# EasyEDA schematic Schematic.json
TITLE: Slide Guardian; REV: 1.0; Date: 2024-06-06; Sheet: 1/1; Drawn By: Internet de las Cosas; Company: Universidad de Cartagena
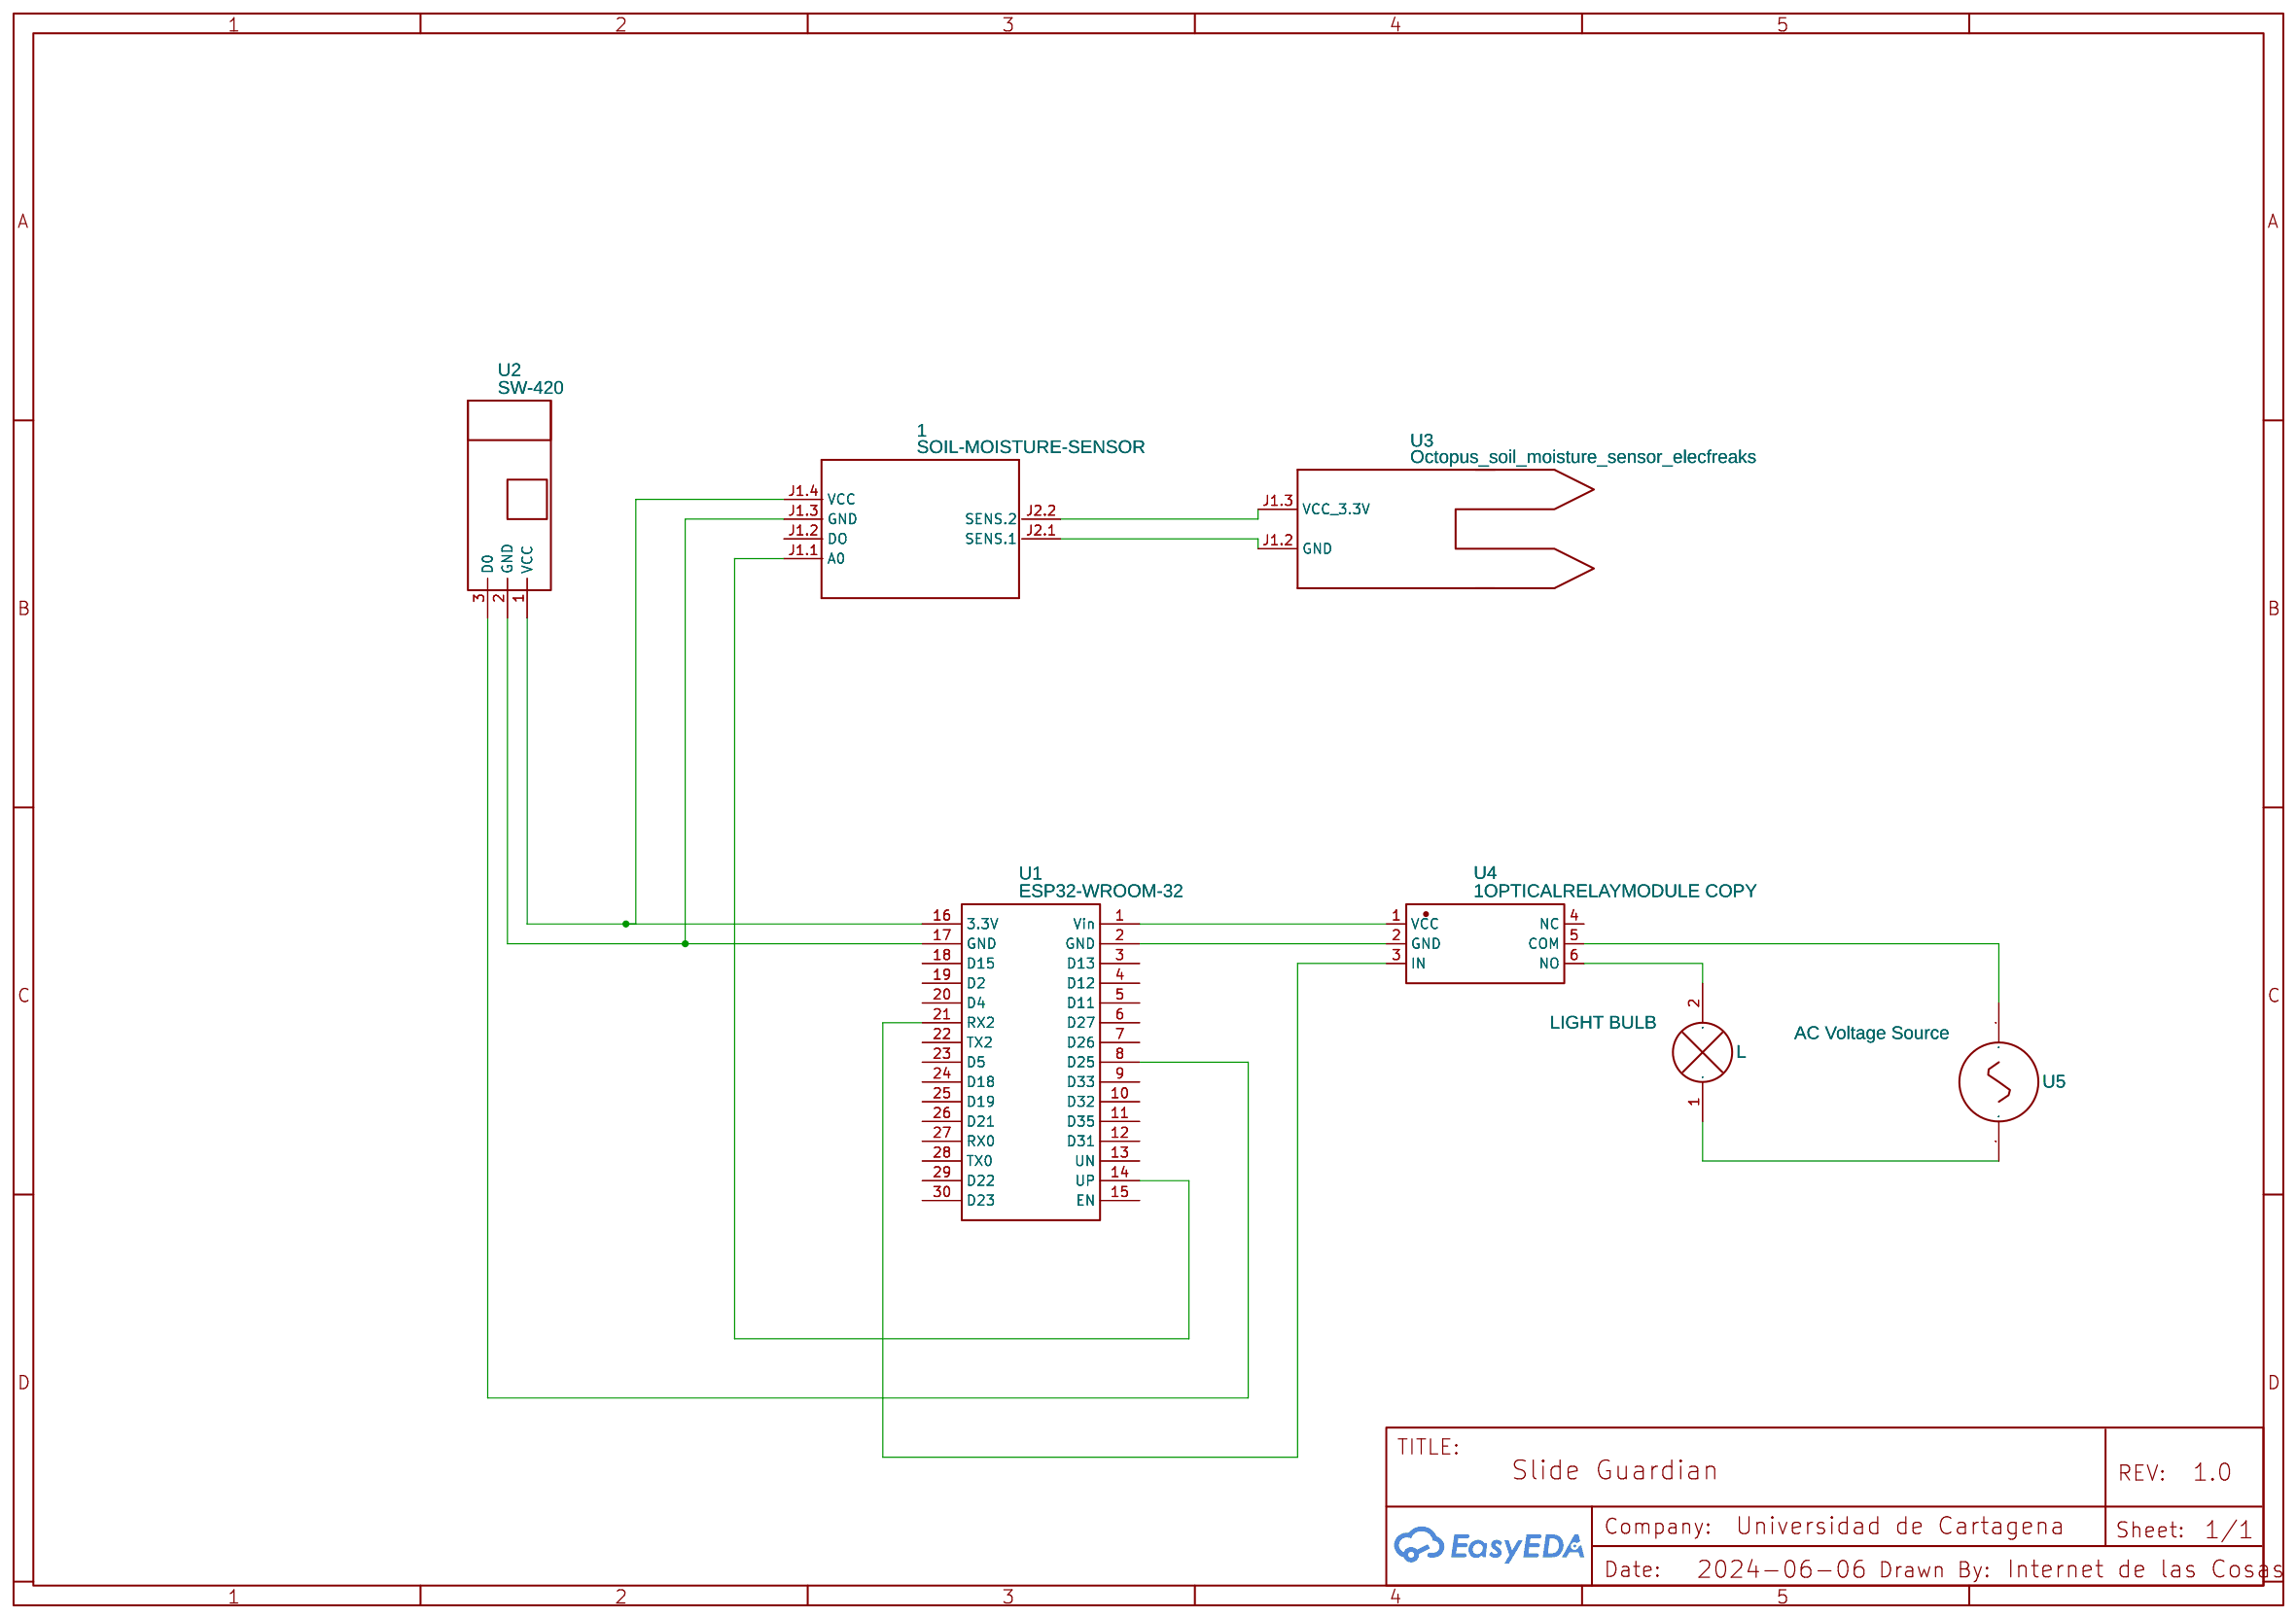
[diagram p0: schematic sheet]

## Parts
1  SOIL-MOISTURE-SENSOR  [SOIL-MOISTURE-SENSOR]
L  LIGHT BULB  [LIGHT BULB]
U1  ESP32-WROOM-32  [ESP32-WROOM-32]
U2  SW-420  [SW-420]
U3  Octopus_soil_moisture_sensor_elecfreaks  [SOIL-MOISTURE-SENSOR]
U4  1OPTICALRELAYMODULE COPY  [1OPTICALRELAYMODULE]
U5  AC Voltage Source  [AC VOLTAGE SOURCE]

## Library data of the parts
1 = SOIL-MOISTURE-SENSOR: Contributor: Otto Sonneveld
L = LIGHT BULB: Contributor: Wosky
U1 = ESP32-WROOM-32: Manufacturer: Espressif; Supplier: Espressif; link: https://www.espressif.com/sites/default/files/documentation/esp32_datasheet_en.pdf; Contributor: jripolla
U2 = SW-420: link: https://www.aliexpress.com/item/Free-shipping-Normally-Closed-Type-Vibration-Sensor-Module-for-arduino/32786773275.html?spm=a2g0o.cart.99999999.334.20bf3c004M4x0z; Contributor: northonh
U3 = Octopus_soil_moisture_sensor_elecfreaks: Soil Moisture Sensor; sourceId: 2R3DBz96s
U4 = 1OPTICALRELAYMODULE COPY: Contributor: mitho
U5 = AC Voltage Source: Contributor: haiqal

## Nets
Net-(1-J1.1): 1.J1.1(A0) U1.14(UP)
Net-(1-J1.3): 1.J1.3(GND) U1.17(GND) U2.2(GND)
Net-(1-J1.4): 1.J1.4(VCC) U1.16(3.3V) U2.1(VCC)
Net-(1-J2.1): 1.J2.1(SENS.1) U3.J1.2(GND)
Net-(1-J2.2): 1.J2.2(SENS.2) U3.J1.3(VCC 3.3V)
Net-(L-1): L.1 U5.2
Net-(L-2): L.2 U4.6(NO)
Net-(U1-1): U1.1(Vin) U4.1(VCC)
Net-(U1-2): U1.2(GND) U4.2(GND)
Net-(U1-8): U1.8(D25) U2.3(D0)
Net-(U1-21): U1.21(RX2) U4.3(IN)
Net-(U4-5): U4.5(COM) U5.1

Not connected (* = marked no-connect by the designer): 1 J1.2(DO); U1 3(D13) 4(D12) 5(D11) 6(D27) 7(D26) 9(D33) 10(D32) 11(D35) 12(D31) 13(UN) 15(EN) 18(D15) 19(D2) 20(D4) 22(TX2) 23(D5) 24(D18) 25(D19) 26(D21) 27(RX0) 28(TX0) 29(D22) 30(D23); U4 4(NC)
